# Altium project MB1635.PrjPcb (part 1 of 4)
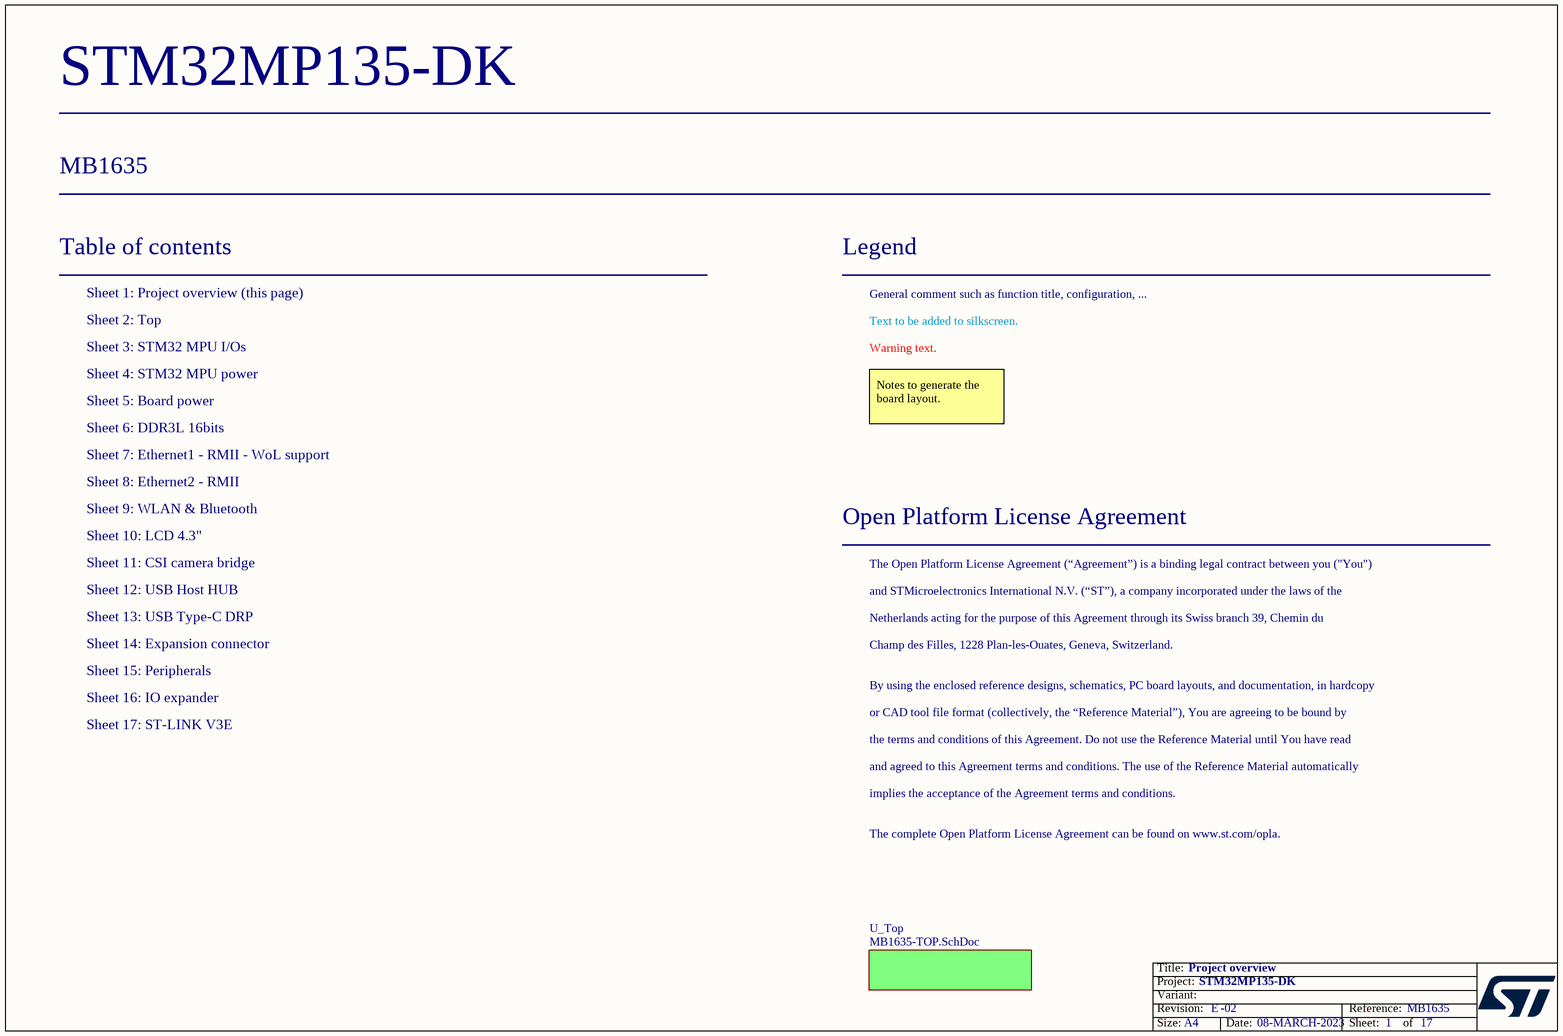
[diagram p0: MB1635_Project_Overview.SchDoc]
Board_Reference: MB1635; Board_PCB_Revision: E; Board_Name: STM32MP135-DK; Board_Document_Date: 08-MARCH-2023; Board_Assembly_Revision: 02
9 sheets, 318 parts. Net scope: flat (ports and power ports of the same name join across sheets).
Board file: MB1635.PcbDoc
Sheets:
  MB1635_Project_Overview.SchDoc
  MP135_11x11.SchDoc
  Power_MPU.SchDoc
  Power_Board.SchDoc
  LCD4.3.SchDoc
  USB_TypeC_DRP.SchDoc
  Expansion_Connector.SchDoc
  MCP_IO_expander.SchDoc
  ST-Link_V3E.SchDoc

## Sheet MB1635_Project_Overview.SchDoc: Project overview
size A4; Date: Not used; ApprovedBy: Not used; CheckedBy: Not used; Author: Not used; CompanyName: STMicroelectronics; DrawnBy: Not used; Engineer: Not used; Organization: Not used; Address1: Not used; Address2: Not used; Address3: Not used; Address4: Not used; DocumentNumber: 1; Revision: Not used; SheetNumber: 1; SheetTotal: 17; CurrentTime: Not used; CurrentDate: Not used; Time: Not used; DocumentFullPathAndName: Not used; DocumentName: Not used; ModifiedDate: Not used; ImagePath: Not used; ProjectName: Not used; Application_BuildNumber: Not used

### Sub-sheets
U_Top = MB1635-TOP.SchDoc (file not in this document): no entries

### Notes on the sheet
- Table of contents
- Sheet 1: Project overview (this page)
- Legend
- General comment such as function title, configuration, ...
- Sheet 2: Top
- Sheet 3: STM32 MPU I/Os
- Sheet 4: STM32 MPU power
- Text to be added to silkscreen.
- Warning text.
- Sheet 6: DDR3L 16bits
- Sheet 5: Board power
- Notes to generate the board layout.
- Sheet 7: Ethernet1 - RMII - WoL support
- Sheet 8: Ethernet2 - RMII
- Sheet 9: WLAN & Bluetooth
- Sheet 10: LCD 4.3"
- Sheet 11: CSI camera bridge
- Open Platform License Agreement
- The Open Platform License Agreement (“Agreement”) is a binding legal contract between you ("You")
- Sheet 13: USB Type-C DRP
- Sheet 12: USB Host HUB
- Sheet 14: Expansion connector
- and STMicroelectronics International N.V. (“ST”), a company incorporated under the laws of the
- Netherlands acting for the purpose of this Agreement through its Swiss branch 39, Chemin du
- Champ des Filles, 1228 Plan-les-Ouates, Geneva, Switzerland.
- Sheet 15: Peripherals
- Sheet 16: IO expander
- By using the enclosed reference designs, schematics, PC board layouts, and documentation, in hardcopy
- or CAD tool file format (collectively, the “Reference Material”), You are agreeing to be bound by
- Sheet 17: ST-LINK V3E
- the terms and conditions of this Agreement. Do not use the Reference Material until You have read
- and agreed to this Agreement terms and conditions. The use of the Reference Material automatically
- implies the acceptance of the Agreement terms and conditions.
- The complete Open Platform License Agreement can be found on www.st.com/opla.
- Title:
- Project:
- Size:
- Revision:
- Variant:
- A4
- -
- Date:
- Reference:
- Sheet:
- of

## Sheet MP135_11x11.SchDoc: STM32 MPU I/Os
size A3; Date: Not used; ApprovedBy: Not used; CheckedBy: Not used; Author: Not used; CompanyName: STMicroelectronics; DrawnBy: Not used; Engineer: Not used; Organization: Not used; Address1: Not used; Address2: Not used; Address3: Not used; Address4: Not used; DocumentNumber: 3; Revision: Not used; SheetNumber: 3; SheetTotal: 17; CurrentTime: Not used; CurrentDate: Not used; Time: Not used; DocumentFullPathAndName: Not used; DocumentName: Not used; ModifiedDate: Not used; ImagePath: Not used; ProjectName: Not used; Application_BuildNumber: Not used
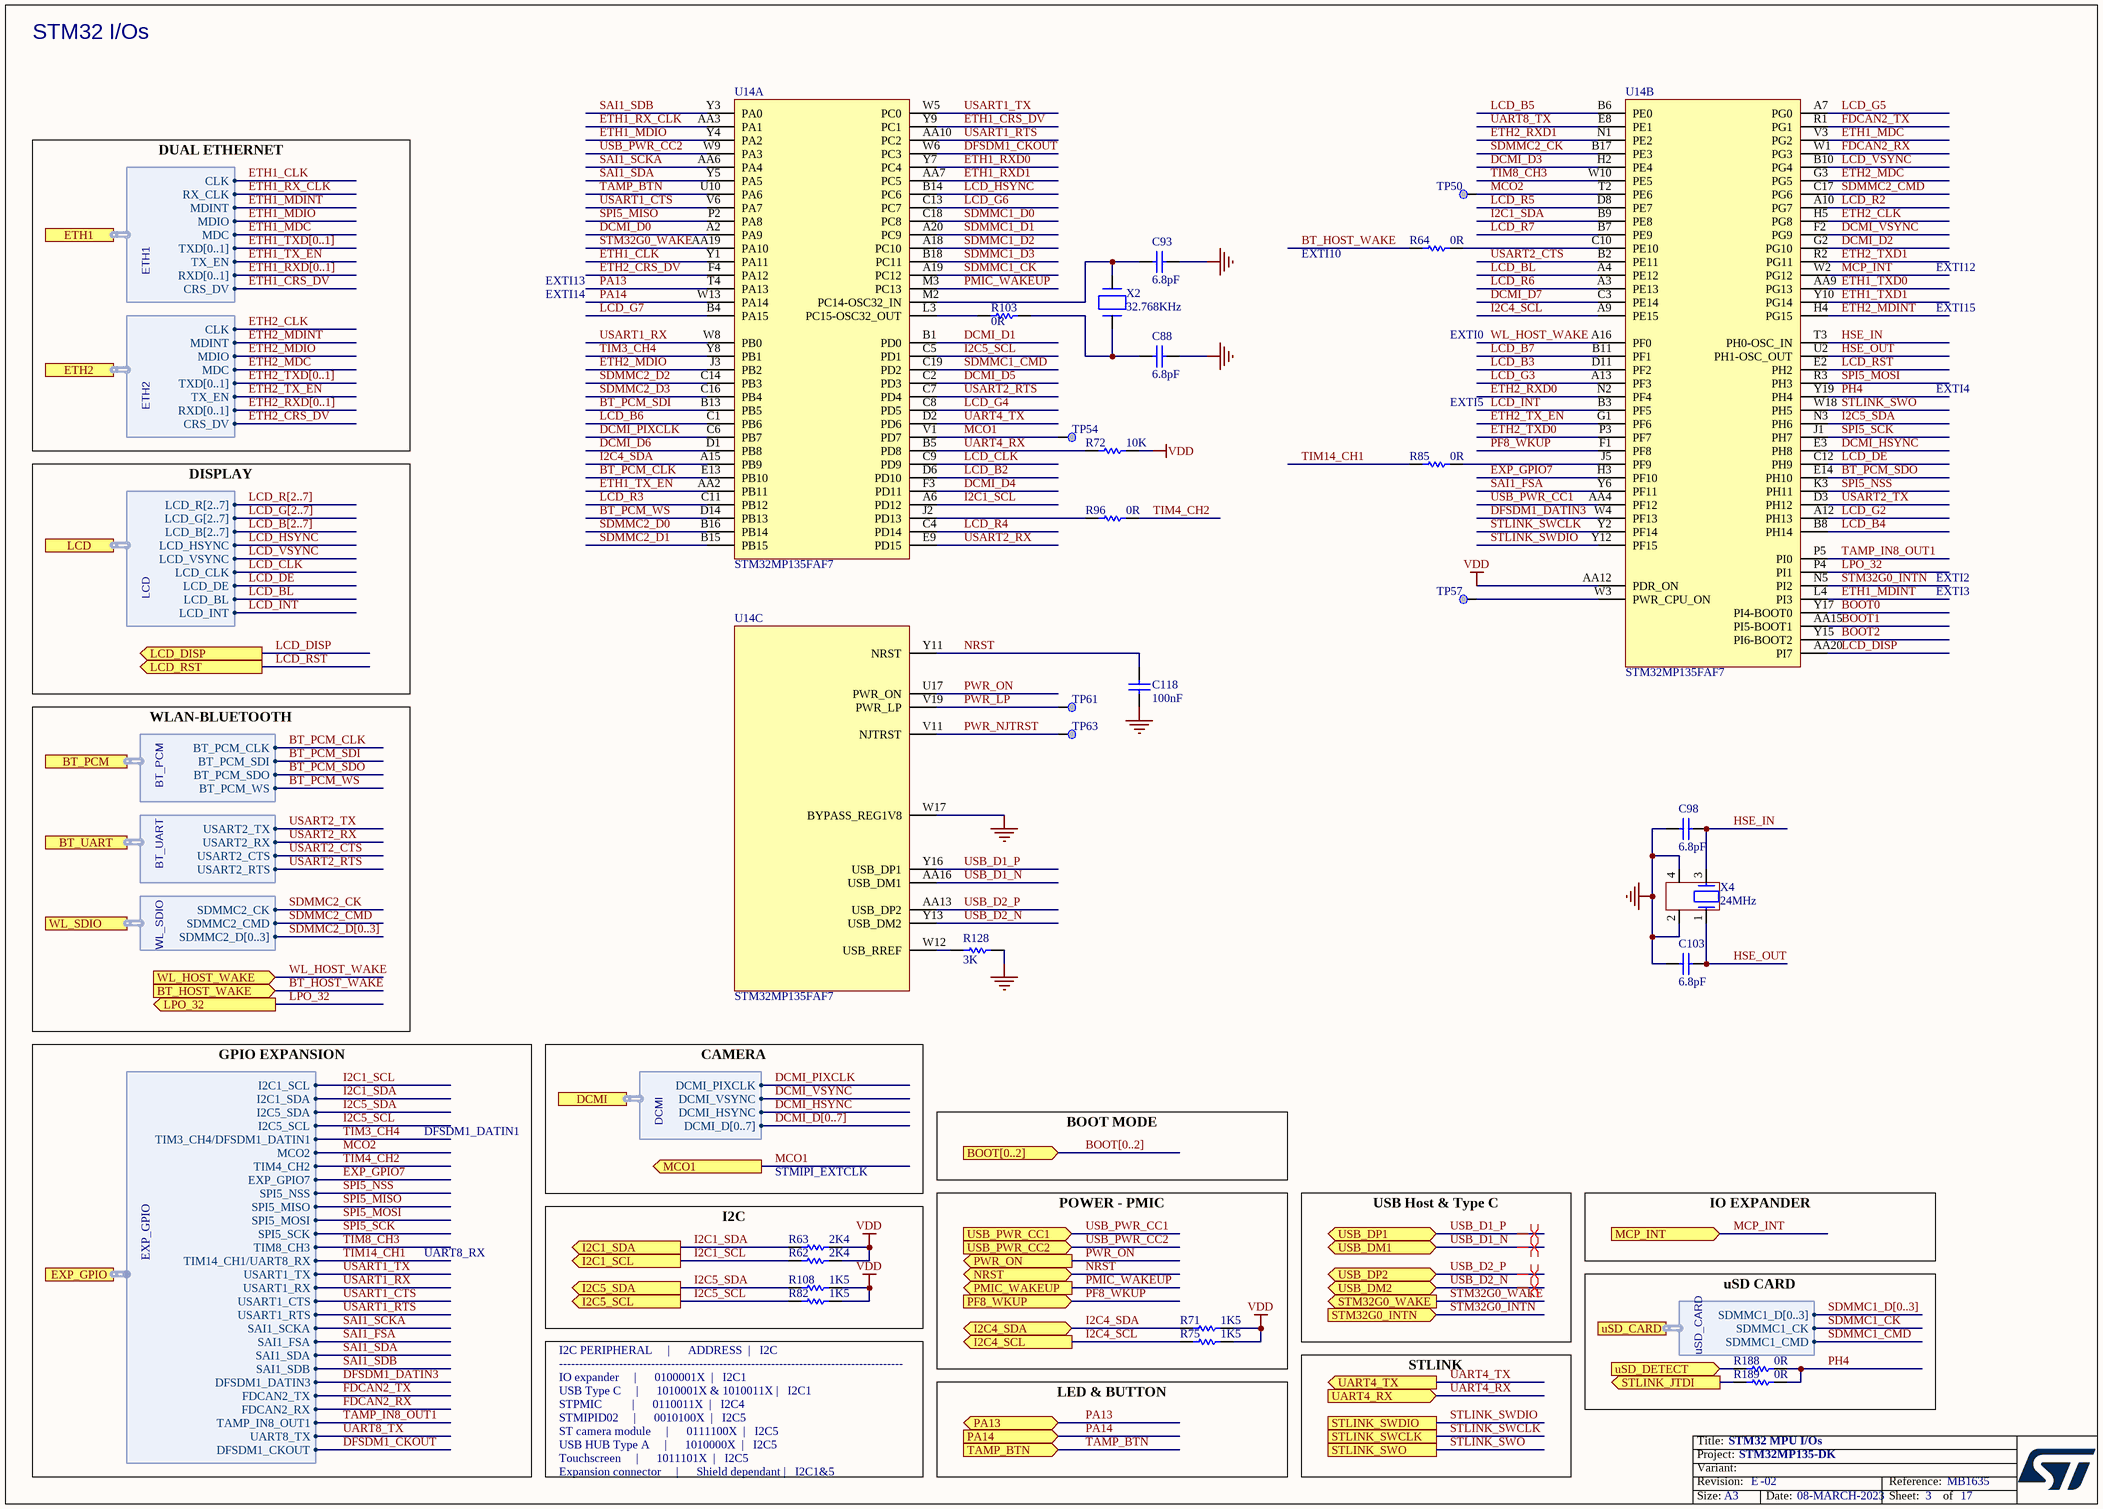
[diagram p1: MP135_11x11.SchDoc]

### Parts
C88  value 6.8pF  [C0402]  (hidden comment: Capacitor)
C93  value 6.8pF  [C0402]  (hidden comment: Capacitor)
C98  value 6.8pF  [C0402]  (hidden comment: Capacitor)
C103  value 6.8pF  [C0402]  (hidden comment: Capacitor)
C118  value 100nF  [C0402]  (hidden comment: Capacitor)
R62  value 2K4  [R0402]  (hidden comment: Resistor)
R63  value 2K4  [R0402]  (hidden comment: Resistor)
R64  value 0R  [R0402]  (hidden comment: Resistor)
R71  value 1K5  [R0402]  (hidden comment: Resistor)
R72  value 10K  [R0402]  (hidden comment: Resistor)
R75  value 1K5  [R0402]  (hidden comment: Resistor)
R82  value 1K5  [R0402]  (hidden comment: Resistor)
R85  value 0R  [R0402]  (hidden comment: Resistor)
R96  value 0R  [R0402]  (hidden comment: Resistor)
R103  value 0R  [R0402]  (hidden comment: Resistor)
R108  value 1K5  [R0402]  (hidden comment: Resistor)
R128  value 3K  [R0402]  (hidden comment: Resistor)
R188  value 0R  [R0402]  (hidden comment: Resistor)
R189  value 0R  [R0402]  (hidden comment: Resistor)
TP50  Test Point  [TP_SMD_1MM]  (value not drawn)  (no BOM)
TP54  Test Point  [TP_SMD_1MM]  (value not drawn)  (no BOM)
TP57  Test Point  [TP_SMD_1MM]  (value not drawn)  (no BOM)
TP61  Test Point  [TP_SMD_1MM]  (value not drawn)  (no BOM)
TP63  Test Point  [TP_SMD_1MM]  (value not drawn)  (no BOM)
U14  STM32MP135FAF7  [ICC_TFBGA320_11X11_STM32MP135FA7_P050_H1P20]  (parts A,B,C of 5)
X2  value 32.768KHz  [CRY_NX2012SA_2P]  (hidden comment: XTAL_2_PINS)
X4  value 24MHz  [CRY_NX2016SA_4P]  (hidden comment: XTAL_4_PINS)

### Ports
BOOT[0..2] (in), BT_HOST_WAKE (in), BT_PCM (harness BT_PCM), BT_UART (harness BT_UART), DCMI (harness DCMI), ETH1 (harness ETH1), ETH2 (harness ETH2), EXP_GPIO (harness EXP_GPIO), I2C1_SCL (out), I2C1_SDA (out), I2C4_SCL (out), I2C4_SDA (bidir), I2C5_SCL (out), I2C5_SDA (out), LCD (harness LCD), LCD_DISP (out), LCD_RST (out), LPO_32 (out), MCO1 (out), MCP_INT (in), NRST (bidir), PA13 (bidir), PA14 (in), PF8_WKUP (in), PMIC_WAKEUP (out), PWR_ON (out), STLINK_JTDI (out), STLINK_SWCLK, STLINK_SWDIO, STLINK_SWO, STM32G0_INTN (in), STM32G0_WAKE (out), TAMP_BTN (in), UART4_RX (in), UART4_TX (out), USB_DM1 (bidir), USB_DM2 (bidir), USB_DP1 (bidir), USB_DP2 (bidir), USB_PWR_CC1 (in), USB_PWR_CC2 (in), uSD_CARD (harness uSD_CARD), uSD_DETECT (in), WL_HOST_WAKE (in), WL_SDIO (harness WL_SDIO)

### Harnesses
BT_PCM: BT_PCM_CLK, BT_PCM_SDI, BT_PCM_SDO, BT_PCM_WS
BT_UART: USART2_TX, USART2_RX, USART2_CTS, USART2_RTS
WL_SDIO: SDMMC2_CMD, SDMMC2_CK, SDMMC2_D[0..3]
LCD: LCD_R[2..7], LCD_G[2..7], LCD_B[2..7], LCD_HSYNC, LCD_VSYNC, LCD_DE, LCD_CLK, LCD_BL, LCD_INT
DCMI: DCMI_D[0..7], DCMI_HSYNC, DCMI_VSYNC, DCMI_PIXCLK
ETH2: MDINT, TXD[0..1], MDIO, MDC, TX_EN, RXD[0..1], CRS_DV, CLK
ETH1: MDINT, TXD[0..1], MDIO, MDC, RX_CLK, TX_EN, RXD[0..1], CRS_DV, CLK
uSD_CARD: SDMMC1_D[0..3], SDMMC1_CK, SDMMC1_CMD
EXP_GPIO: I2C1_SCL, I2C1_SDA, I2C5_SDA, MCO2, TIM8_CH3, DFSDM1_DATIN3, SPI5_NSS, SPI5_MISO, SPI5_MOSI, SPI5_SCK, TIM4_CH2, USART1_TX, USART1_RX, USART1_CTS, USART1_RTS, UART8_TX, TIM14_CH1/UART8_RX, FDCAN2_TX, FDCAN2_RX, DFSDM1_CKOUT, TIM3_CH4/DFSDM1_DATIN1, I2C5_SCL, SAI1_SCKA, SAI1_FSA, SAI1_SDA, SAI1_SDB, TAMP_IN8_OUT1, EXP_GPIO7

### Nets
GND: C88.2 C93.2 C98.1 C103.2 C118.2 R128.2 U14.W17(BYPASS_REG1V8) X4.2 X4.4
VDD: R62.2 R63.2 R71.2 R72.2 R75.2 R82.2 R108.2 U14.AA12(PDR_ON)
BOOT0: U14.Y17(PI4-BOOT0)
BOOT1: U14.AA15(PI5-BOOT1)
BOOT2: U14.Y15(PI6-BOOT2)
BT_HOST_WAKE: R64.1 ; port BT_HOST_WAKE
BT_PCM_CLK: U14.E13(PB10) ; port BT_PCM.BT_PCM_CLK
BT_PCM_SDI: U14.B13(PB5) ; port BT_PCM.BT_PCM_SDI
BT_PCM_SDO: U14.E14(PH10) ; port BT_PCM.BT_PCM_SDO
BT_PCM_WS: U14.D14(PB13) ; port BT_PCM.BT_PCM_WS
DCMI_D0: U14.A2(PA9)
DCMI_D1: U14.B1(PD0)
DCMI_D2: U14.G2(PG10)
DCMI_D3: U14.H2(PE4)
DCMI_D4: U14.F3(PD11)
DCMI_D5: U14.C2(PD3)
DCMI_D6: U14.D1(PB8)
DCMI_D7: U14.C3(PE14)
DCMI_HSYNC: U14.E3(PH8) ; port DCMI.DCMI_HSYNC
DCMI_PIXCLK: U14.C6(PB7) ; port DCMI.DCMI_PIXCLK
DCMI_VSYNC: U14.F2(PG9) ; port DCMI.DCMI_VSYNC
DFSDM1_CKOUT: U14.W6(PC3) ; port EXP_GPIO.DFSDM1_CKOUT
DFSDM1_DATIN3: U14.W4(PF13) ; port EXP_GPIO.DFSDM1_DATIN3
ETH1_CLK: U14.Y1(PA11) ; port ETH1.CLK
ETH1_CRS_DV: U14.Y9(PC1) ; port ETH1.CRS_DV
ETH1_MDC: U14.V3(PG2) ; port ETH1.MDC
ETH1_MDINT: U14.L4(PI3) ; port ETH1.MDINT
ETH1_MDIO: U14.Y4(PA2) ; port ETH1.MDIO
ETH1_RX_CLK: U14.AA3(PA1) ; port ETH1.RX_CLK
ETH1_RXD0: U14.Y7(PC4)
ETH1_RXD1: U14.AA7(PC5)
ETH1_TX_EN: U14.AA2(PB11) ; port ETH1.TX_EN
ETH1_TXD0: U14.AA9(PG13)
ETH1_TXD1: U14.Y10(PG14)
ETH2_CLK: U14.H5(PG8) ; port ETH2.CLK
ETH2_CRS_DV: U14.F4(PA12) ; port ETH2.CRS_DV
ETH2_MDC: U14.G3(PG5) ; port ETH2.MDC
ETH2_MDINT: U14.H4(PG15) ; port ETH2.MDINT
ETH2_MDIO: U14.J3(PB2) ; port ETH2.MDIO
ETH2_RXD0: U14.N2(PF4)
ETH2_RXD1: U14.N1(PE2)
ETH2_TX_EN: U14.G1(PF6) ; port ETH2.TX_EN
ETH2_TXD0: U14.P3(PF7)
ETH2_TXD1: U14.R2(PG11)
EXP_GPIO7: U14.H3(PF10) ; port EXP_GPIO.EXP_GPIO7
FDCAN2_RX: U14.W1(PG3) ; port EXP_GPIO.FDCAN2_RX  [project net EXP_GPIO24]
FDCAN2_TX: U14.R1(PG1) ; port EXP_GPIO.FDCAN2_TX  [project net EXP_GPIO23]
HSE_IN: C98.2 U14.T3(PH0-OSC_IN) X4.3
HSE_OUT: C103.1 U14.U2(PH1-OSC_OUT) X4.1
I2C1_SCL: R62.1 U14.A6(PD12) ; port I2C1_SCL, port EXP_GPIO.I2C1_SCL
I2C1_SDA: R63.1 U14.B9(PE8) ; port I2C1_SDA, port EXP_GPIO.I2C1_SDA
I2C4_SCL: R75.1 U14.A9(PE15) ; port I2C4_SCL
I2C4_SDA: R71.1 U14.A15(PB9) ; port I2C4_SDA
I2C5_SCL: R82.1 U14.C5(PD1) ; port I2C5_SCL, port EXP_GPIO.I2C5_SCL  [project net EXP_GPIO3]
I2C5_SDA: R108.1 U14.N3(PH6) ; port I2C5_SDA, port EXP_GPIO.I2C5_SDA  [project net EXP_GPIO2]
LCD_B2: U14.D6(PD10)
LCD_B3: U14.D11(PF2)
LCD_B4: U14.B8(PH14)
LCD_B5: U14.B6(PE0)
LCD_B6: U14.C1(PB6)
LCD_B7: U14.B11(PF1)
LCD_BL: U14.A4(PE12) ; port LCD.LCD_BL
LCD_CLK: U14.C9(PD9) ; port LCD.LCD_CLK
LCD_DE: U14.C12(PH9) ; port LCD.LCD_DE
LCD_DISP: U14.AA20(PI7) ; port LCD_DISP
LCD_G2: U14.A12(PH13)
LCD_G3: U14.A13(PF3)
LCD_G4: U14.C8(PD5)
LCD_G5: U14.A7(PG0)
LCD_G6: U14.C13(PC7)
LCD_G7: U14.B4(PA15)
LCD_HSYNC: U14.B14(PC6) ; port LCD.LCD_HSYNC
LCD_INT: U14.B3(PF5) ; port LCD.LCD_INT
LCD_R2: U14.A10(PG7)
LCD_R3: U14.C11(PB12)
LCD_R4: U14.C4(PD14)
LCD_R5: U14.D8(PE7)
LCD_R6: U14.A3(PE13)
LCD_R7: U14.B7(PE9)
LCD_RST: U14.E2(PH2) ; port LCD_RST
LCD_VSYNC: U14.B10(PG4) ; port LCD.LCD_VSYNC
LPO_32: U14.P4(PI1) ; port LPO_32
MCO1: TP54.1 U14.V1(PD7) ; port MCO1
MCO2: TP50.1 U14.T2(PE6) ; port EXP_GPIO.MCO2  [project net EXP_GPIO5]
MCP_INT: U14.W2(PG12) ; port MCP_INT
NRST: C118.1 U14.Y11(NRST) ; port NRST
PA13: U14.T4(PA13) ; port PA13
PA14: U14.W13(PA14) ; port PA14
PF8_WKUP: U14.F1(PF8) ; port PF8_WKUP
PH4: R188.2 R189.2 U14.Y19(PH4)
PMIC_WAKEUP: U14.M3(PC13) ; port PMIC_WAKEUP
PWR_LP: TP61.1 U14.V19(PWR_LP)
PWR_NJTRST: TP63.1 U14.V11(NJTRST)
PWR_ON: U14.U17(PWR_ON) ; port PWR_ON
SAI1_FSA: U14.Y6(PF11) ; port EXP_GPIO.SAI1_FSA  [project net EXP_GPIO19]
SAI1_SCKA: U14.AA6(PA4) ; port EXP_GPIO.SAI1_SCKA  [project net EXP_GPIO18]
SAI1_SDA: U14.Y5(PA5) ; port EXP_GPIO.SAI1_SDA  [project net EXP_GPIO20]
SAI1_SDB: U14.Y3(PA0) ; port EXP_GPIO.SAI1_SDB  [project net EXP_GPIO21]
SDMMC1_CK: U14.A19(PC12) ; port uSD_CARD.SDMMC1_CK
SDMMC1_CMD: U14.C19(PD2) ; port uSD_CARD.SDMMC1_CMD
SDMMC1_D0: U14.C18(PC8)
SDMMC1_D1: U14.A20(PC9)
SDMMC1_D2: U14.A18(PC10)
SDMMC1_D3: U14.B18(PC11)
SDMMC2_CK: U14.B17(PE3) ; port WL_SDIO.SDMMC2_CK
SDMMC2_CMD: U14.C17(PG6) ; port WL_SDIO.SDMMC2_CMD
SDMMC2_D0: U14.B16(PB14)
SDMMC2_D1: U14.B15(PB15)
SDMMC2_D2: U14.C14(PB3)
SDMMC2_D3: U14.C16(PB4)
SPI5_MISO: U14.P2(PA8) ; port EXP_GPIO.SPI5_MISO  [project net EXP_GPIO9]
SPI5_MOSI: U14.R3(PH3) ; port EXP_GPIO.SPI5_MOSI  [project net EXP_GPIO10]
SPI5_NSS: U14.K3(PH11) ; port EXP_GPIO.SPI5_NSS  [project net EXP_GPIO8]
SPI5_SCK: U14.J1(PH7) ; port EXP_GPIO.SPI5_SCK  [project net EXP_GPIO11]
STLINK_SWCLK: U14.Y2(PF14) ; port STLINK_SWCLK
STLINK_SWDIO: U14.Y12(PF15) ; port STLINK_SWDIO
STLINK_SWO: U14.W18(PH5) ; port STLINK_SWO
STM32G0_INTN: U14.N5(PI2) ; port STM32G0_INTN
STM32G0_WAKE: U14.AA19(PA10) ; port STM32G0_WAKE
T_JTDI: R189.1 ; port STLINK_JTDI
TAMP_BTN: U14.U10(PA6) ; port TAMP_BTN
TAMP_IN8_OUT1: U14.P5(PI0) ; port EXP_GPIO.TAMP_IN8_OUT1  [project net EXP_GPIO25]
TIM3_CH4: U14.Y8(PB1) ; port EXP_GPIO.TIM3_CH4/DFSDM1_DATIN1  [project net EXP_GPIO4]
TIM4_CH2: R96.2 ; port EXP_GPIO.TIM4_CH2  [project net EXP_GPIO6]
TIM8_CH3: U14.W10(PE5) ; port EXP_GPIO.TIM8_CH3  [project net EXP_GPIO12]
TIM14_CH1: R85.1 ; port EXP_GPIO.TIM14_CH1/UART8_RX  [project net EXP_GPIO13]
UART4_RX: R72.1 U14.B5(PD8) ; port UART4_RX
UART4_TX: U14.D2(PD6) ; port UART4_TX
UART8_TX: U14.E8(PE1) ; port EXP_GPIO.UART8_TX  [project net EXP_GPIO26]
USART1_CTS: U14.V6(PA7) ; port EXP_GPIO.USART1_CTS  [project net EXP_GPIO16]
USART1_RTS: U14.AA10(PC2) ; port EXP_GPIO.USART1_RTS  [project net EXP_GPIO17]
USART1_RX: U14.W8(PB0) ; port EXP_GPIO.USART1_RX  [project net EXP_GPIO15]
USART1_TX: U14.W5(PC0) ; port EXP_GPIO.USART1_TX  [project net EXP_GPIO14]
USART2_CTS: U14.B2(PE11) ; port BT_UART.USART2_CTS
USART2_RTS: U14.C7(PD4) ; port BT_UART.USART2_RTS
USART2_RX: U14.E9(PD15) ; port BT_UART.USART2_RX
USART2_TX: U14.D3(PH12) ; port BT_UART.USART2_TX
USB_D1_N: U14.AA16(USB_DM1) ; port USB_DM1
USB_D1_P: U14.Y16(USB_DP1) ; port USB_DP1
USB_D2_N: U14.Y13(USB_DM2) ; port USB_DM2
USB_D2_P: U14.AA13(USB_DP2) ; port USB_DP2
USB_PWR_CC1: U14.AA4(PF12) ; port USB_PWR_CC1
USB_PWR_CC2: U14.W9(PA3) ; port USB_PWR_CC2
uSD_DETECT: R188.1 ; port uSD_DETECT
WL_HOST_WAKE: U14.A16(PF0) ; port WL_HOST_WAKE
NetC88_1: C88.1 R103.2 X2.1(X1)
NetC93_1: C93.1 U14.M2(PC14-OSC32_IN) X2.2(X2)
NetR64_2: R64.2 U14.C10(PE10)
NetR85_2: R85.2 U14.J5(PF9)
NetR96_1: R96.1 U14.J2(PD13)
NetR103_1: R103.1 U14.L3(PC15-OSC32_OUT)
NetR128_1: R128.1 U14.W12(USB_RREF)
NetTP57_1: TP57.1 U14.W3(PWR_CPU_ON)

### Buses and harness runs
bus BOOT[0..2] = port BOOT[0..2]
bus DCMI_D[0..7]
bus ETH1_RXD[0..1]
bus ETH1_TXD[0..1]
bus ETH2_RXD[0..1]
bus ETH2_TXD[0..1]
bus LCD_B[2..7]
bus LCD_G[2..7]
bus LCD_R[2..7]
bus SDMMC1_D[0..3]
bus SDMMC2_D[0..3]

### Layout directives
differential pair: USB_D1_N, USB_D1_P, USB_D2_N, USB_D2_P

### Notes on the sheet
- STM32 I/Os
- EXTI14
- EXTI13
- EXTI10
- EXTI12
- EXTI15
- EXTI0
- DUAL ETHERNET
- EXTI5
- EXTI4
- EXTI2
- EXTI3
- DISPLAY
- WLAN-BLUETOOTH
- DFSDM1_DATIN1
- CAMERA
- STMIPI_EXTCLK
- BOOT MODE
- UART8_RX
- IO EXPANDER
- I2C
- POWER - PMIC
- USB Host & Type C
- uSD CARD
- GPIO EXPANSION
- I2C PERIPHERAL	    |      ADDRESS		|   I2C
  --------------------------------------------------------------------------------------
  IO expander	    |      0100001X		|   I2C1
  USB Type C	    |      1010001X & 1010011X	|   I2C1
  STPMIC	    	    |      0110011X		|   I2C4
  STMIPID02	    |      0010100X		|   I2C5
  ST camera module	    |      0111100X		|   I2C5
  USB HUB Type A	    |      1010000X		|   I2C5
  Touchscreen	    |      1011101X		|   I2C5
  Expansion connector	    |      Shield dependant	|   I2C1&5
- LED & BUTTON
- STLINK
- Title:
- Project:
- Size:
- Revision:
- Variant:
- A3
- -
- Date:
- Reference:
- Sheet:
- of

### Library data of the parts
C88 C93 C98 C103 = MCD-00674: Capacitor, MLCC, 6.8pF, 50V, NPO, +/-0.25pF, 0402, T=0.5mm; Manufacturer_Part_Number: CC0402CRNPO9BN6R8; Manufacturer: YAGEO; Part_Preference: Recommended; Component_Country_Of_Origin: China; ShowFields: YES; ID: 3068; Internal_Part_Number: MCD-00674; Status: Released; Part_Type: Capacitor; Package: 0402; ComponentLink1URL: http://tunmcdsvn.tun.st.com/Component_Documentation_Library/Trunk/Capacitor/YAGEO_NP0_Series; Order_Code_Digikey: 311-3327-1-ND; Order_Code_Farnell: N/A; Order_Code_RS: N/A
C118 = MCD-00006: Capacitor, MLCC, 100nF, 16V, X7R, +/-10%, 0402, T=0.5mm; Manufacturer_Part_Number: CC0402KRX7R7BB104; Manufacturer: YAGEO; Part_Preference: Recommended; Order_Code_RS: 616-9701; Component_Country_Of_Origin: China; ShowFields: YES; ID: 2474; Internal_Part_Number: MCD-00006; Status: Released; Part_Type: Capacitor; Package: 0402; ComponentLink1URL: http://tunmcdsvn.tun.st.com/Component_Documentation_Library/Trunk/Capacitor/YAGEO_X7R_Series; Order_Code_Digikey: 311-1338-1-ND; Order_Code_Farnell: 9402047
R62 R63 = MCD-00433: Resistor, 2K4, 0402, +/-1%, 1/16W; Part_Preference: Recommended; Manufacturer: YAGEO; Manufacturer_Part_Number: RC0402FR-072K4L; Component_Country_Of_Origin: China; ShowFields: YES; ID: 2843; Internal_Part_Number: MCD-00433; Status: Released; Part_Type: Resistor; Package: 0402; ComponentLink1URL: http://tunmcdsvn.tun.st.com/Component_Documentation_Library/Trunk/Resistor/YAGEO_RC_L_Series; Order_Code_Digikey: 311-2.40KLRCT-ND; Order_Code_Farnell: 1458767; Order_Code_RS: N/A
R64 R85 R96 R188 R189 = MCD-00052: Resistor, 0R, 0402, +/-5%, 1/16W; Part_Preference: Recommended; Manufacturer: YAGEO; Manufacturer_Part_Number: RC0402JR-070RL; Order_Code_RS: 618-5804; Component_Country_Of_Origin: China; ShowFields: YES; ID: 2540; Internal_Part_Number: MCD-00052; Status: Released; Part_Type: Resistor; Package: 0402; ComponentLink1URL: http://tunmcdsvn.tun.st.com/Component_Documentation_Library/Trunk/Resistor/YAGEO_RC_L_Series; Order_Code_Digikey: 311-0.0JRCT-ND; Order_Code_Farnell: 9232516RL
R71 R75 R82 R108 = MCD-00068: Resistor, 1K5, 0402, +/-1%, 1/16W; Part_Preference: Recommended; Manufacturer: YAGEO; Manufacturer_Part_Number: RC0402FR-071K5L; Component_Country_Of_Origin: China; ShowFields: YES; ID: 2524; Internal_Part_Number: MCD-00068; Status: Released; Part_Type: Resistor; Package: 0402; ComponentLink1URL: http://tunmcdsvn.tun.st.com/Component_Documentation_Library/Trunk/Resistor/YAGEO_RC_L_Series; Order_Code_Digikey: 311-1.50KLRCT-ND; Order_Code_Farnell: 9239251; Order_Code_RS: N/A
R72 = MCD-00053: Resistor, 10K, 0402, +/-1%, 1/16W; Manufacturer_Part_Number: RC0402FR-0710KL; Manufacturer: YAGEO; BMS_Part_Number: 9131590; Part_Preference: Recommended; Component_Country_Of_Origin: China; ShowFields: YES; ID: 2539; Internal_Part_Number: MCD-00053; Status: Released; Part_Type: Resistor; Package: 0402; ComponentLink1URL: http://tunmcdsvn.tun.st.com/Component_Documentation_Library/Trunk/Resistor/YAGEO_RC_L_Series; Order_Code_Digikey: 311-10.0KLRCT-ND; Order_Code_Farnell: 9239359; Order_Code_RS: N/A
R103 = MCD-00052: Resistor, 0R, 0402, +/-5%, 1/16W; Manufacturer_Part_Number: RC0402JR-070RL; Manufacturer: YAGEO; Part_Preference: Recommended; Order_Code_RS: 618-5804; Component_Country_Of_Origin: China; ShowFields: YES; ID: 2540; Internal_Part_Number: MCD-00052; Status: Released; Part_Type: Resistor; ComponentLink1URL: http://tunmcdsvn.tun.st.com/Component_Documentation_Library/Trunk/Resistor/YAGEO_RC_L_Series; Package: 0402; Order_Code_Digikey: 311-0.0JRCT-ND; Order_Code_Farnell: 9232516RL
R128 = MCD-00185: Resistor, 3K, 0402, +/-1%, 1/16W; Part_Preference: Recommended; Manufacturer: YAGEO; Manufacturer_Part_Number: RC0402FR-073KL; Component_Country_Of_Origin: China; ShowFields: YES; ID: 2682; Internal_Part_Number: MCD-00185; Status: Released; Part_Type: Resistor; Package: 0402; ComponentLink1URL: http://tunmcdsvn.tun.st.com/Component_Documentation_Library/Trunk/Resistor/YAGEO_RC_L_Series; Order_Code_Digikey: 311-3KLRCT-ND; Order_Code_Farnell: 1458777; Order_Code_RS: N/A
TP50 TP54 TP57 TP61 TP63 = MCD-00074: Test Point 1mm; Part_Type: Misc; Part_Preference: Recommended; ShowFields: YES; ID: 2518; Internal_Part_Number: MCD-00074; Status: Released; Manufacturer_Part_Number: N/A; Manufacturer: N/A; ComponentLink1URL: http://na; Order_Code_Digikey: N/A; Order_Code_Farnell: N/A; Order_Code_RS: N/A
U14 = MCD-02251: Cortex-A7 @ 900MHz, 128KB-ROM, 128KB-SRAM, 2x Ethernet, 2x ADC, 2x CAN FD, TSC, Camera, Display, Secure Boot, Cryptography, DRAM enc/dec, PKA; Part_Preference: Recommended; Part_Type: IC; Manufacturer: STMICROELECTRONICS; Manufacturer_HQ_COO: EU; Component_Country_Of_Origin: Unknown; ShowFields: YES; ID: 4351; Internal_Part_Number: MCD-02251; Value: STM32MP135FAF7; Status: Checked; Manufacturer_Part_Number: STM32MP135FAF7; Package: TFBGA320; ComponentLink1URL: http://tunmcdsvn.tun.st.com/Component_Datasheet_Library/Trunk/Socket_IC/STM_MPU_STM32MP135FAF7_Socket; Order_Code_Digikey: N/A; Order_Code_Farnell: N/A; Order_Code_RS: N/A
X2 = MCD-01479: Crystal, 32.768kHz, 6pF, +/-20ppm, 80K, 2.05x1.2mm; Part_Type: Crystal_Osc; Manufacturer_Part_Number: NX2012SA-32.768KHZ-EXS00A-MU00527; Manufacturer: NDK; BMS_Part_Number: 9157049; Part_Preference: Recommended; Component_Country_Of_Origin: Unknown; ShowFields: YES; ID: 3579; Internal_Part_Number: MCD-01479; Status: Released; Package: 2.05x1.2mm; ComponentLink1URL: http://tunmcdsvn.tun.st.com/Component_Documentation_Library/Trunk/Crytal_Oscillator/NDK_NX2012SA_Series; Order_Code_Digikey: 644-1352; Order_Code_Farnell: N/A; Order_Code_RS: N/A
X4 = MCD-01036: Crystal, 24MHz, 6pF, +/-20ppm, 80R, 2x1.6mm; BMS_Part_Number: 9157045; Part_Type: Crystal_Osc; Part_Preference: Recommended; Manufacturer: NDK; Manufacturer_Part_Number: NX2016SA-24MHZ-EXS00A-CS10820; Component_Country_Of_Origin: Unknown; ShowFields: YES; ID: 2989; Internal_Part_Number: MCD-01036; Status: Released; Package: 2x1.6mm; ComponentLink1URL: http://tunmcdsvn.tun.st.com/Component_Documentation_Library/Trunk/Crytal_Oscillator/NDK_NX2016SA_Series; Order_Code_Digikey: 644-1365; Order_Code_Farnell: N/A; Order_Code_RS: N/A

## Sheet Power_MPU.SchDoc: STM32 MPU power
size A3; Date: Not used; ApprovedBy: Not used; CheckedBy: Not used; Author: Not used; CompanyName: STMicroelectronics; DrawnBy: Not used; Engineer: Not used; Organization: Not used; Address1: Not used; Address2: Not used; Address3: Not used; Address4: Not used; DocumentNumber: 4; Revision: Not used; SheetNumber: 4; SheetTotal: 17; CurrentTime: Not used; CurrentDate: Not used; Time: Not used; DocumentFullPathAndName: Not used; DocumentName: Not used; ModifiedDate: Not used; ImagePath: Not used; ProjectName: Not used; Application_BuildNumber: Not used
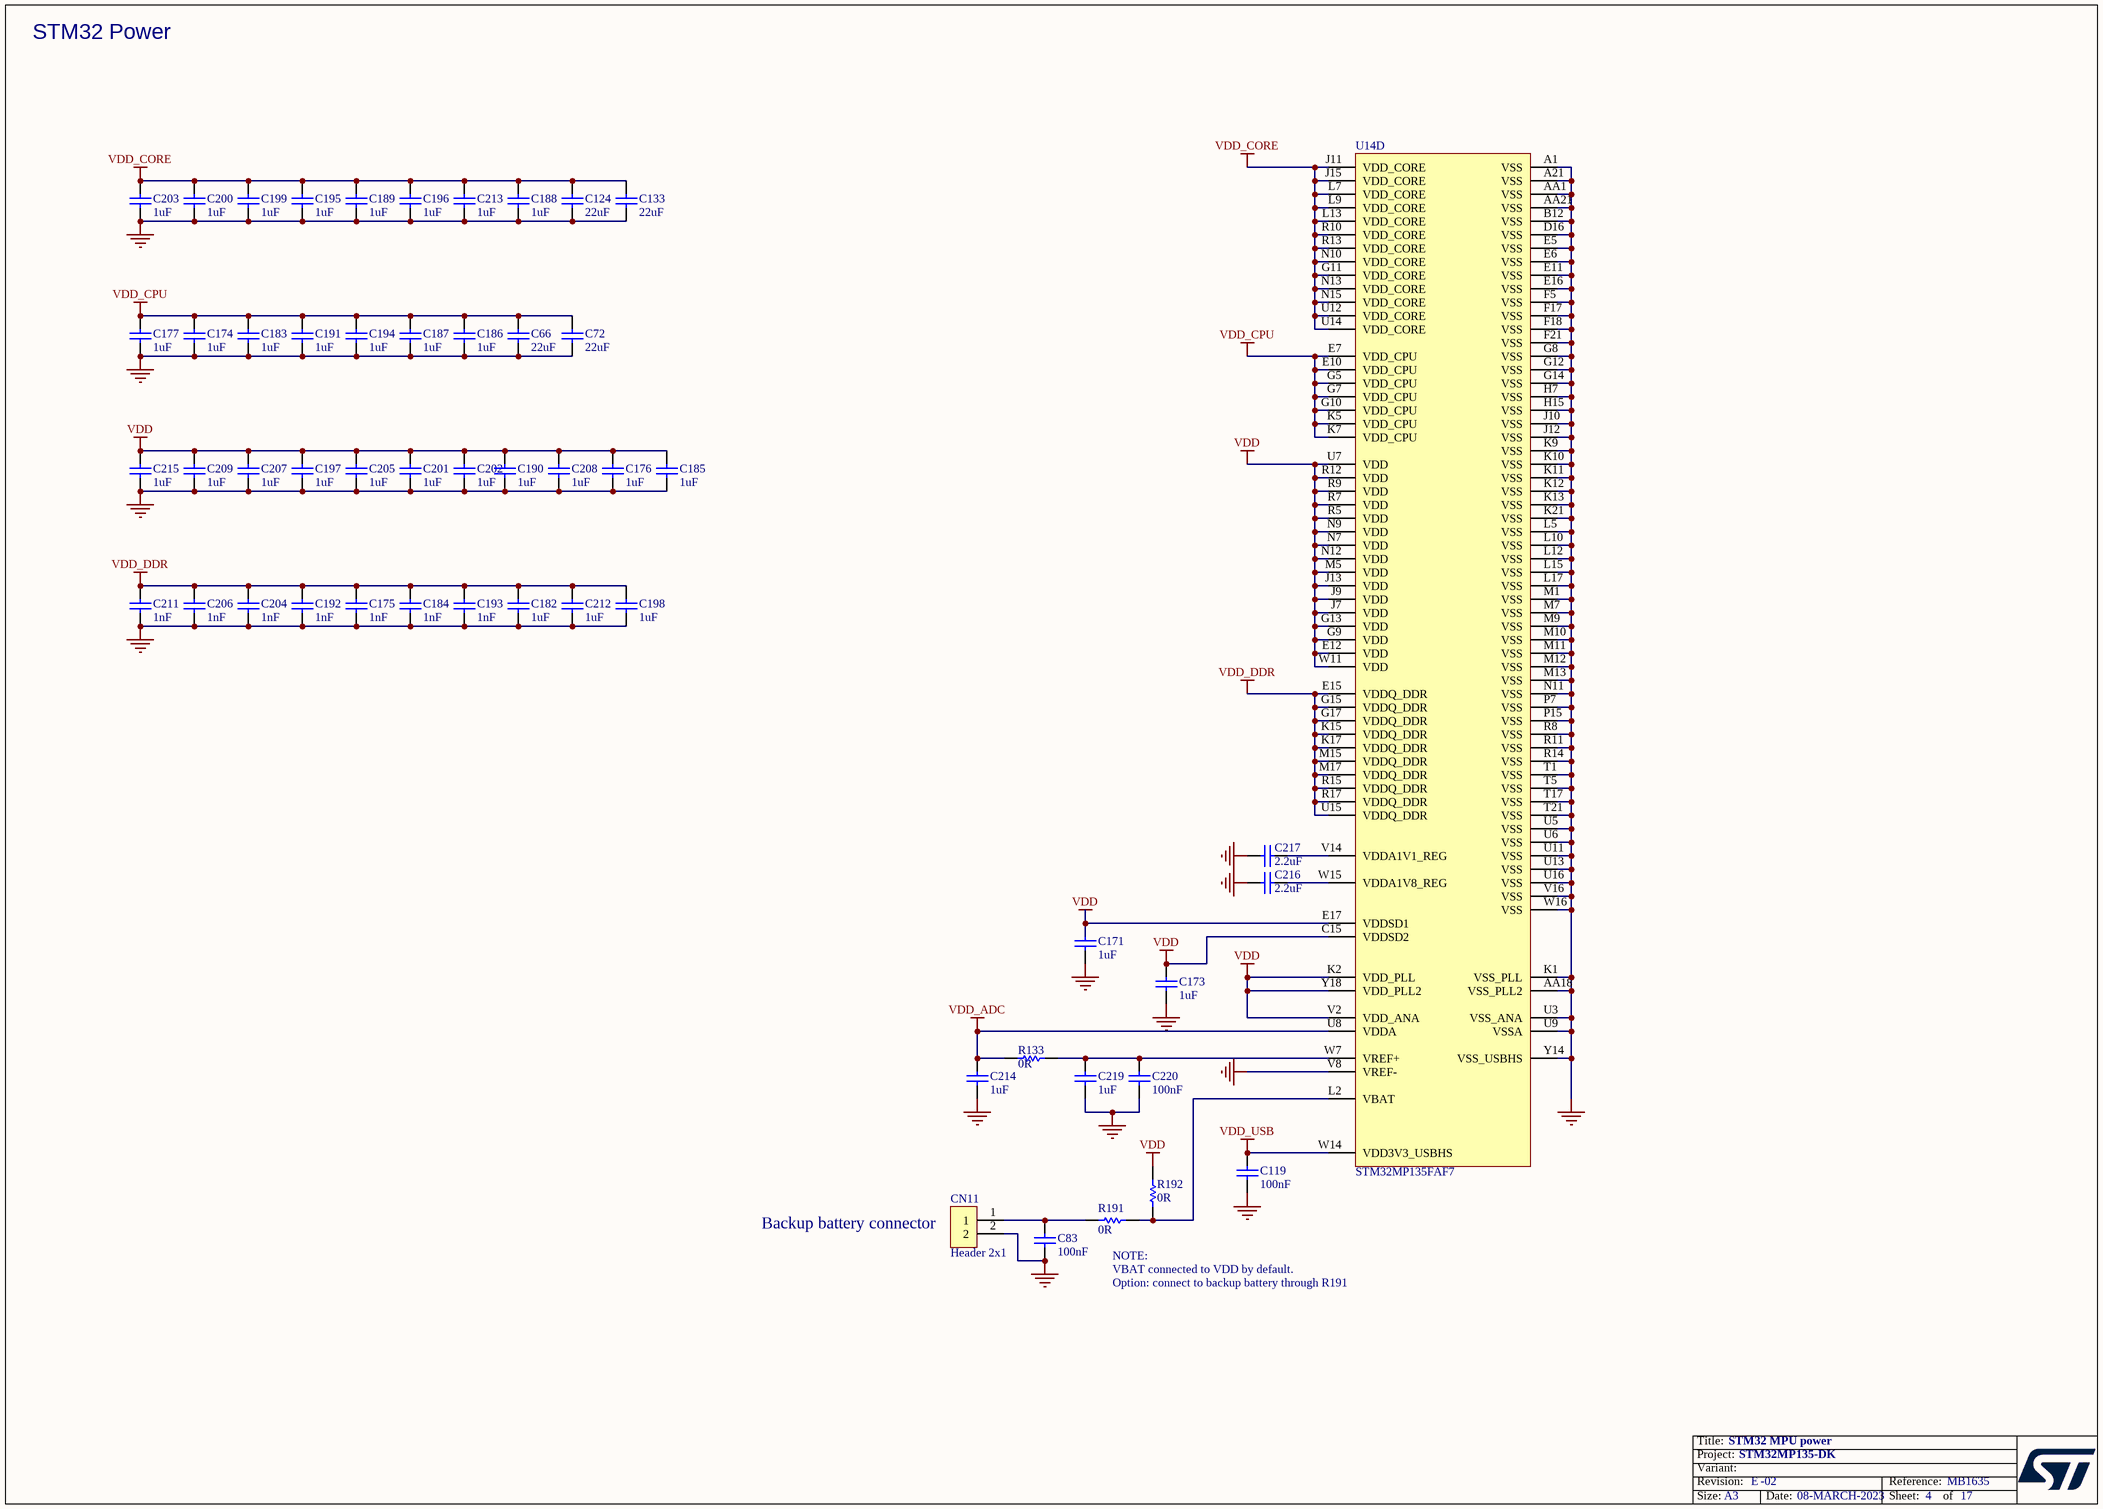
[diagram p2: Power_MPU.SchDoc]

### Parts
C66  value 22uF  [C0603]  (hidden comment: Capacitor)
C72  value 22uF  [C0603]  (hidden comment: Capacitor)
C83  value 100nF  [C0402]  (hidden comment: Capacitor)
C119  value 100nF  [C0402]  (hidden comment: Capacitor)
C124  value 22uF  [C0603]  (hidden comment: Capacitor)
C133  value 22uF  [C0603]  (hidden comment: Capacitor)
C171  value 1uF  [C0201_MURATA_GRM033_H0P3]  (hidden comment: Capacitor)
C173  value 1uF  [C0201_MURATA_GRM033_H0P3]  (hidden comment: Capacitor)
C174  value 1uF  [C0201_MURATA_GRM033_H0P3]  (hidden comment: Capacitor)
C175  value 1nF  [C0201_MURATA_GRM033_H0P3]  (hidden comment: Capacitor)
C176  value 1uF  [C0201_MURATA_GRM033_H0P3]  (hidden comment: Capacitor)
C177  value 1uF  [C0201_MURATA_GRM033_H0P3]  (hidden comment: Capacitor)
C182  value 1uF  [C0201_MURATA_GRM033_H0P3]  (hidden comment: Capacitor)
C183  value 1uF  [C0201_MURATA_GRM033_H0P3]  (hidden comment: Capacitor)
C184  value 1nF  [C0201_MURATA_GRM033_H0P3]  (hidden comment: Capacitor)
C185  value 1uF  [C0201_MURATA_GRM033_H0P3]  (hidden comment: Capacitor)
C186  value 1uF  [C0201_MURATA_GRM033_H0P3]  (hidden comment: Capacitor)
C187  value 1uF  [C0201_MURATA_GRM033_H0P3]  (hidden comment: Capacitor)
C188  value 1uF  [C0201_MURATA_GRM033_H0P3]  (hidden comment: Capacitor)
C189  value 1uF  [C0201_MURATA_GRM033_H0P3]  (hidden comment: Capacitor)
C190  value 1uF  [C0201_MURATA_GRM033_H0P3]  (hidden comment: Capacitor)
C191  value 1uF  [C0201_MURATA_GRM033_H0P3]  (hidden comment: Capacitor)
C192  value 1nF  [C0201_MURATA_GRM033_H0P3]  (hidden comment: Capacitor)
C193  value 1nF  [C0201_MURATA_GRM033_H0P3]  (hidden comment: Capacitor)
C194  value 1uF  [C0201_MURATA_GRM033_H0P3]  (hidden comment: Capacitor)
C195  value 1uF  [C0201_MURATA_GRM033_H0P3]  (hidden comment: Capacitor)
C196  value 1uF  [C0201_MURATA_GRM033_H0P3]  (hidden comment: Capacitor)
C197  value 1uF  [C0201_MURATA_GRM033_H0P3]  (hidden comment: Capacitor)
C198  value 1uF  [C0201_MURATA_GRM033_H0P3]  (hidden comment: Capacitor)
C199  value 1uF  [C0201_MURATA_GRM033_H0P3]  (hidden comment: Capacitor)
C200  value 1uF  [C0201_MURATA_GRM033_H0P3]  (hidden comment: Capacitor)
C201  value 1uF  [C0201_MURATA_GRM033_H0P3]  (hidden comment: Capacitor)
C202  value 1uF  [C0201_MURATA_GRM033_H0P3]  (hidden comment: Capacitor)
C203  value 1uF  [C0201_MURATA_GRM033_H0P3]  (hidden comment: Capacitor)
C204  value 1nF  [C0201_MURATA_GRM033_H0P3]  (hidden comment: Capacitor)
C205  value 1uF  [C0201_MURATA_GRM033_H0P3]  (hidden comment: Capacitor)
C206  value 1nF  [C0201_MURATA_GRM033_H0P3]  (hidden comment: Capacitor)
C207  value 1uF  [C0201_MURATA_GRM033_H0P3]  (hidden comment: Capacitor)
C208  value 1uF  [C0201_MURATA_GRM033_H0P3]  (hidden comment: Capacitor)
C209  value 1uF  [C0201_MURATA_GRM033_H0P3]  (hidden comment: Capacitor)
C211  value 1nF  [C0201_MURATA_GRM033_H0P3]  (hidden comment: Capacitor)
C212  value 1uF  [C0201_MURATA_GRM033_H0P3]  (hidden comment: Capacitor)
C213  value 1uF  [C0201_MURATA_GRM033_H0P3]  (hidden comment: Capacitor)
C214  value 1uF  [C0201_MURATA_GRM033_H0P3]  (hidden comment: Capacitor)
C215  value 1uF  [C0201_MURATA_GRM033_H0P3]  (hidden comment: Capacitor)
C216  value 2.2uF  [C0201_H0P5]  (hidden comment: Capacitor)
C217  value 2.2uF  [C0201_H0P5]  (hidden comment: Capacitor)
C219  value 1uF  [C0201_MURATA_GRM033_H0P3]  (hidden comment: Capacitor)
C220  value 100nF  [C0402]  (hidden comment: Capacitor)
CN11  Header 2x1  [CON_MOLEX_53047-0210]
R133  value 0R  [R0402]  (hidden comment: Resistor)
R191  value 0R  [R0402]  (hidden comment: Resistor)
R192  value 0R  [R0402]  (hidden comment: Resistor)
U14  STM32MP135FAF7  [ICC_TFBGA320_11X11_STM32MP135FA7_P050_H1P20]  (part D of 5)

### Nets
GND: C66.1 C72.1 C83.1 C119.1 C124.1 C133.1 C171.1 C173.1 C174.1 C175.1 C176.1 C177.2 C182.1 C183.1 C184.1 C185.2 C186.1 C187.1 C188.1 C189.1 C190.1 C191.2 C192.1 C193.1 C194.1 C195.2 C196.1 C197.1 C198.1 C199.1 C200.1 C201.1 C202.1 C203.2 C204.2 C205.1 C206.1 C207.2 C208.1 C209.1 C211.1 C212.1 C213.1 C214.2 C215.2 C216.2 C217.2 C219.2 C220.1 CN11.2 U14.A1(VSS) U14.A21(VSS) U14.AA1(VSS) U14.AA18(VSS_PLL2) U14.AA21(VSS) U14.B12(VSS) U14.D16(VSS) U14.E5(VSS) U14.E6(VSS) U14.E11(VSS) U14.E16(VSS) U14.F5(VSS) U14.F17(VSS) U14.F18(VSS) U14.F21(VSS) U14.G8(VSS) U14.G12(VSS) U14.G14(VSS) U14.H7(VSS) U14.H15(VSS) U14.J10(VSS) U14.J12(VSS) U14.K1(VSS_PLL) U14.K9(VSS) U14.K10(VSS) U14.K11(VSS) U14.K12(VSS) U14.K13(VSS) U14.K21(VSS) U14.L5(VSS) U14.L10(VSS) U14.L12(VSS) U14.L15(VSS) U14.L17(VSS) U14.M1(VSS) U14.M7(VSS) U14.M9(VSS) U14.M10(VSS) U14.M11(VSS) U14.M12(VSS) U14.M13(VSS) U14.N11(VSS) U14.P7(VSS) U14.P15(VSS) U14.R8(VSS) U14.R11(VSS) U14.R14(VSS) U14.T1(VSS) U14.T5(VSS) U14.T17(VSS) U14.T21(VSS) U14.U3(VSS_ANA) U14.U5(VSS) U14.U6(VSS) U14.U9(VSSA) U14.U11(VSS) U14.U13(VSS) U14.U16(VSS) U14.V8(VREF-) U14.V16(VSS) U14.W16(VSS) U14.Y14(VSS_USBHS)
VDD: C171.2 C173.2 C176.2 C185.1 C190.2 C197.2 C201.2 C202.2 C205.2 C207.1 C208.2 C209.2 C215.1 R192.2 U14.C15(VDDSD2) U14.E12(VDD) U14.E17(VDDSD1) U14.G9(VDD) U14.G13(VDD) U14.J7(VDD) U14.J9(VDD) U14.J13(VDD) U14.K2(VDD_PLL) U14.M5(VDD) U14.N7(VDD) U14.N9(VDD) U14.N12(VDD) U14.R5(VDD) U14.R7(VDD) U14.R9(VDD) U14.R12(VDD) U14.U7(VDD) U14.V2(VDD_ANA) U14.W11(VDD) U14.Y18(VDD_PLL2)
VDD_ADC: C214.1 R133.2 U14.U8(VDDA)
VDD_CORE: C124.2 C133.2 C188.2 C189.2 C195.1 C196.2 C199.2 C200.2 C203.1 C213.2 U14.G11(VDD_CORE) U14.J11(VDD_CORE) U14.J15(VDD_CORE) U14.L7(VDD_CORE) U14.L9(VDD_CORE) U14.L13(VDD_CORE) U14.N10(VDD_CORE) U14.N13(VDD_CORE) U14.N15(VDD_CORE) U14.R10(VDD_CORE) U14.R13(VDD_CORE) U14.U12(VDD_CORE) U14.U14(VDD_CORE)
VDD_CPU: C66.2 C72.2 C174.2 C177.1 C183.2 C186.2 C187.2 C191.1 C194.2 U14.E7(VDD_CPU) U14.E10(VDD_CPU) U14.G5(VDD_CPU) U14.G7(VDD_CPU) U14.G10(VDD_CPU) U14.K5(VDD_CPU) U14.K7(VDD_CPU)
VDD_DDR: C175.2 C182.2 C184.2 C192.2 C193.2 C198.2 C204.1 C206.2 C211.2 C212.2 U14.E15(VDDQ_DDR) U14.G15(VDDQ_DDR) U14.G17(VDDQ_DDR) U14.K15(VDDQ_DDR) U14.K17(VDDQ_DDR) U14.M15(VDDQ_DDR) U14.M17(VDDQ_DDR) U14.R15(VDDQ_DDR) U14.R17(VDDQ_DDR) U14.U15(VDDQ_DDR)
VDD_USB: C119.2 U14.W14(VDD3V3_USBHS)
NetC83_2: C83.2 CN11.1 R191.2
NetC216_1: C216.1 U14.W15(VDDA1V8_REG)
NetC217_1: C217.1 U14.V14(VDDA1V1_REG)
NetC219_1: C219.1 C220.2 R133.1 U14.W7(VREF+)
NetR191_1: R191.1 R192.1 U14.L2(VBAT)

### Notes on the sheet
- STM32 Power
- (near CN11) Backup battery connector
- NOTE:
  VBAT connected to VDD by default.
  Option: connect to backup battery through R191
- Title:
- Project:
- Size:
- Revision:
- Variant:
- A3
- -
- Date:
- Reference:
- Sheet:
- of

### Library data of the parts
C66 C72 C124 C133 = MCD-00100: Capacitor, MLCC, 22uF, 6V3, X5R, +/-20%, 0603, T=0.8mm; Part_Preference: Recommended; Manufacturer: MURATA; Manufacturer_Part_Number: GRM188R60J226MEA0J; Component_Country_Of_Origin: Japan; ShowFields: YES; ID: 2766; Internal_Part_Number: MCD-00100; Status: Released; Part_Type: Capacitor; Package: 0603; ComponentLink1URL: http://tunmcdsvn.tun.st.com/Component_Documentation_Library/Trunk/Capacitor/MURATA_GRM_Series; Order_Code_Digikey: 490-7612-2-ND; Order_Code_Farnell: N/A; Order_Code_RS: N/A
C83 C119 C220 = MCD-00006: as C118 on sheet MP135_11x11; Internal_Part_Number: MCD-00006; Status: Released; Part_Type: Capacitor; Package: 0402; ComponentLink1URL: http://tunmcdsvn.tun.st.com/Component_Documentation_Library/Trunk/Capacitor/YAGEO_X7R_Series; Order_Code_Digikey: 311-1338-1-ND; Order_Code_Farnell: 9402047
C171 C173 C174 C176 C177 C182 C183 C185-C191 C194-C203 C205 C207-C209 C212-C215 C219 = MCD-02377: Capacitor, MLCC, 1uF, 6.3V, X5R, +/-20%, 0201, T=0,3mm; Part_Preference: Recommended; Manufacturer: MURATA; Manufacturer_Part_Number: GRM033R60J105MEA2; Order_Code_RS: 820-0643; Component_Country_Of_Origin: Japan; ShowFields: YES; ID: 4483; Status: Checked; Internal_Part_Number: MCD-02377; Part_Type: Capacitor; Package: 0201; ComponentLink1URL: http://tunmcdsvn.tun.st.com/Component_Documentation_Library/Trunk/Capacitor/MURATA_GRM_Series/GRM033R60J105MEA2/; Order_Code_Digikey: 490-7229-2-ND; Order_Code_Farnell: 2470448
C175 C184 C192 C193 C204 C206 C211 = MCD-01729: Capacitor, MLCC, 1nF, 25V, X7R,+/-5%, 0201,T=0.3mm; Part_Preference: Recommended; Manufacturer: MURATA; Manufacturer_Part_Number: GRM033R71E102JA01D; Order_Code_RS: 185-1954; Component_Country_Of_Origin: Japan; ShowFields: YES; ID: 3829; Status: Released; Internal_Part_Number: MCD-01729; Part_Type: Capacitor; Package: 0201; ComponentLink1URL: http://tunmcdsvn.tun.st.com/Component_Documentation_Library/Trunk/Capacitor/MURATA_GRM_Series; Order_Code_Digikey: 490-16360-1-ND; Order_Code_Farnell: 2999504
C216 C217 = MCD-02235: Capacitor, MLCC, 2.2uF, 10V, X5R,+/-10%, 0201, T=0.5mm; Manufacturer_Part_Number: GRM033R61A225KE47D; Manufacturer: MURATA; Part_Preference: Recommended; Order_Code_RS: NA; Component_Country_Of_Origin: Japan; ShowFields: YES; ID: 4335; Internal_Part_Number: MCD-02235; Status: Checked; Part_Type: Capacitor; Package: 0201; ComponentLink1URL: http://tunmcdsvn.tun.st.com/Component_Documentation_Library/Trunk/Capacitor/MURATA_GRM_Series; Order_Code_Digikey: 490-13227-1-ND; Order_Code_Farnell: NA
CN11 = MCD-00655: Header, 2x1, 1.25mm, VR, TH, T=2.25mm/2.3mm; Part_Type: Connector; Manufacturer_Part_Number: 53047-0210; Manufacturer: MOLEX; BMS_Part_Number: 9083002; Part_Preference: Recommended; Order_Code_RS: 279-9213; Component_Country_Of_Origin: Unknown; ShowFields: YES; ID: 3091; Internal_Part_Number: MCD-00655; Value: Header 2x1; Status: Checked; ComponentLink1URL: http://tunmcdsvn.tun.st.com/Component_Documentation_Library/Trunk/Connector/MOLEX_53047-0210/; Order_Code_Digikey: WM1731-ND; Order_Code_Farnell: 9733051
R133 R191 R192 = MCD-00052: as R103 on sheet MP135_11x11; Internal_Part_Number: MCD-00052; Status: Released; Part_Type: Resistor; ComponentLink1URL: http://tunmcdsvn.tun.st.com/Component_Documentation_Library/Trunk/Resistor/YAGEO_RC_L_Series; Package: 0402; Order_Code_Digikey: 311-0.0JRCT-ND; Order_Code_Farnell: 9232516RL
U14 = MCD-02251: as U14 on sheet MP135_11x11; Internal_Part_Number: MCD-02251; Value: STM32MP135FAF7; Status: Checked; Manufacturer_Part_Number: STM32MP135FAF7; Package: TFBGA320; ComponentLink1URL: http://tunmcdsvn.tun.st.com/Component_Datasheet_Library/Trunk/Socket_IC/STM_MPU_STM32MP135FAF7_Socket; Order_Code_Digikey: N/A; Order_Code_Farnell: N/A; Order_Code_RS: N/A